# EAGLE design Slave board (EAGLE 9.6.1)
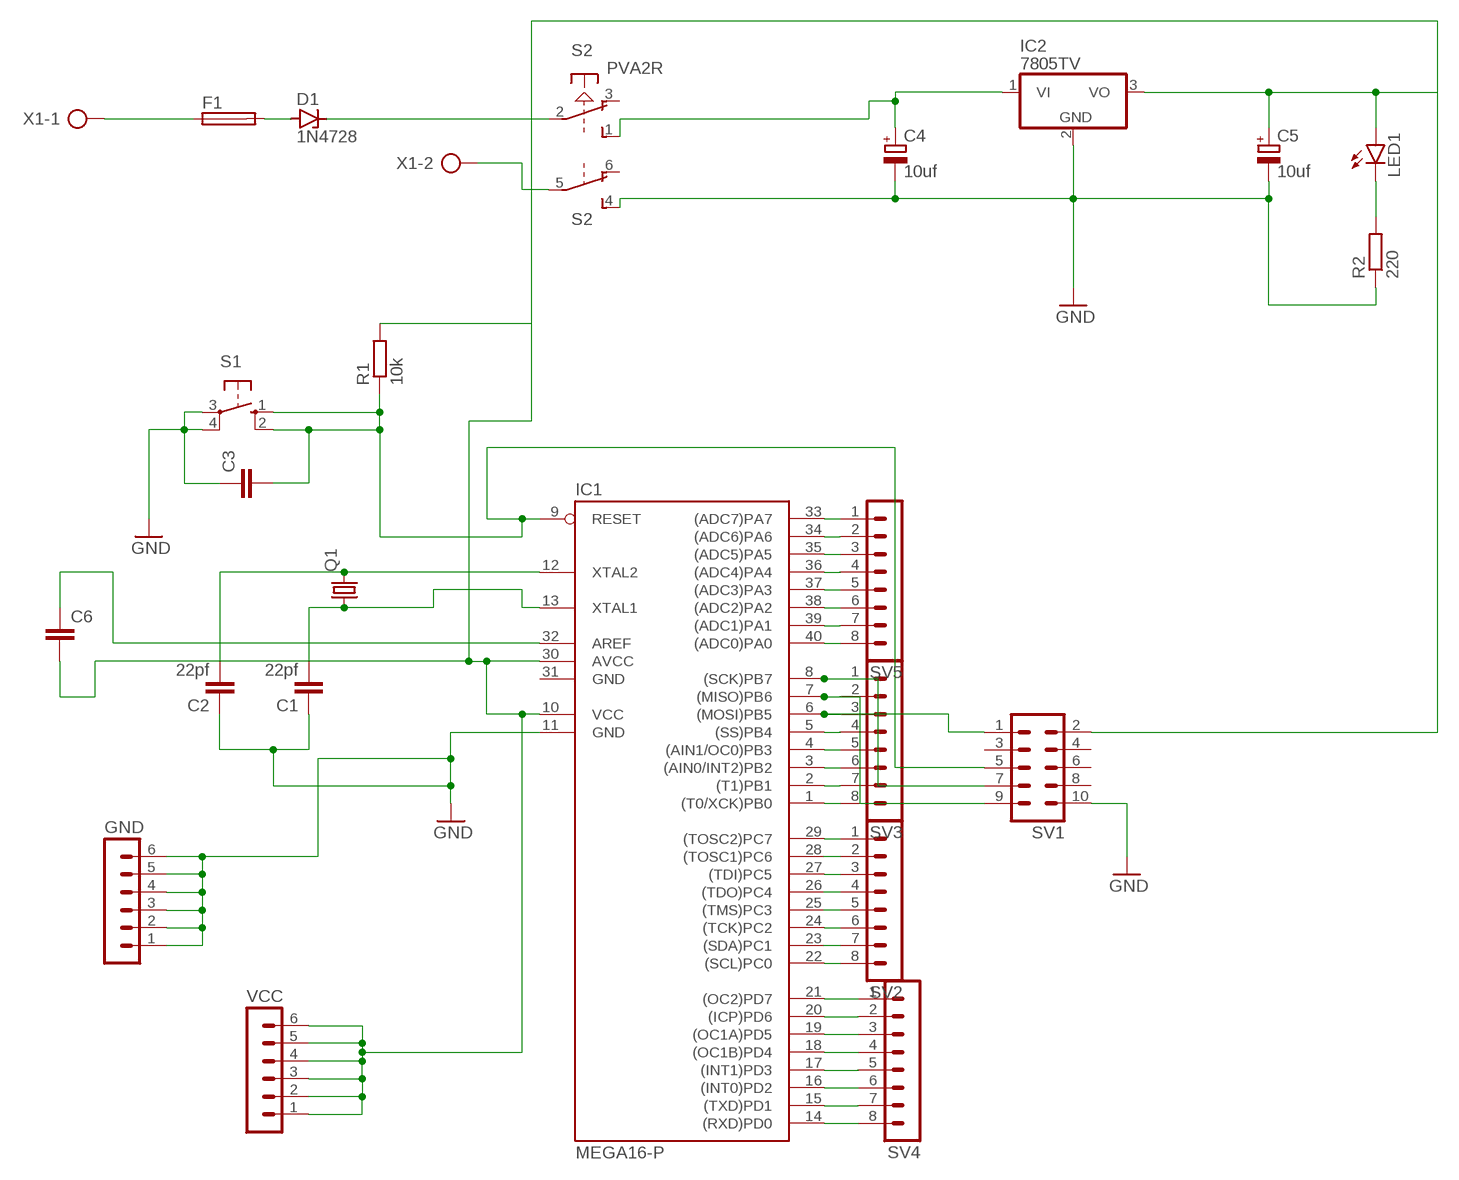
[diagram p0: schematic, sheet 1]

## Parts
C1  22pf  C-EU025-025X050  [C025-025X050]
C2  22pf  C-EU025-025X050  [C025-025X050]
C3  C-EU025-025X050  [C025-025X050]
C4  10uf  CPOL-EUE2.5-6  [E2,5-6]
C5  10uf  CPOL-EUE2.5-6  [E2,5-6]
C6  C-EU025-025X050  [C025-025X050]
D1  1N4728  [DO41Z10]
F1  GSH15  [GSH15]
GND  MA06-1  [MA06-1]
IC1  MEGA16-P  [DIL40]
IC2  7805TV  [TO220V]
LED1  LED5MM  [LED5MM]
Q1  CRYSTALHC49U70  [HC49U70]
R1  10k  R-EU_0207/10  [0207/10]
R2  220  R-EU_0207/10  [0207/10]
S1  10-XX  [B3F-10XX]
S2  PVA2R  [PVA2R]
SV1  MA05-2  [MA05-2]
SV2  MA08-1W  [MA08-1W]
SV3  MA08-1W  [MA08-1W]
SV4  MA08-1W  [MA08-1W]
SV5  MA08-1W  [MA08-1W]
VCC  MA06-1  [MA06-1]
X1  AK500/2  [AK500/2]

## Nets
GND: C1.1 C2.1 C3.1 C4.- C5.- GND.1 GND.2 GND.3 GND.4 GND.5 GND.6 IC1.11(GND) IC2.2(GND) R2.1 S1.3(P) S1.4(P1) S2.4(2:S) SV1.10
N$1: C1.2 IC1.13(XTAL1) Q1.1
N$2: C2.2 IC1.12(XTAL2) Q1.2
N$3: IC1.6((MOSI)PB5) SV1.1 SV3.3
N$4: IC1.7((MISO)PB6) SV1.9 SV3.2
N$5: IC1.8((SCK)PB7) SV1.7 SV3.1
N$6: C4.+ IC2.1(VI) S2.1(1:S)
N$7: IC1.5((SS)PB4) SV3.4
N$8: C3.2 IC1.9(RESET) R1.1 S1.1(S) S1.2(S1) SV1.5
N$9: LED1.K(C) R2.2
N$10: IC1.4((AIN1/OC0)PB3) SV3.5
N$11: IC1.3((AIN0/INT2)PB2) SV3.6
N$12: IC1.2((T1)PB1) SV3.7
N$14: IC1.33((ADC7)PA7) SV5.1
N$15: D1.A F1.2
N$16: F1.1 X1.1
N$17: D1.C S2.2(1:P)
N$18: IC1.34((ADC6)PA6) SV5.2
N$19: S2.5(2:P) X1.2
N$20: IC1.29((TOSC2)PC7) SV2.1
N$22: IC1.27((TDI)PC5) SV2.3
N$23: IC1.26((TDO)PC4) SV2.4
N$24: IC1.25((TMS)PC3) SV2.5
N$25: IC1.24((TCK)PC2) SV2.6
N$26: IC1.23((SDA)PC1) SV2.7
N$27: IC1.22((SCL)PC0) SV2.8
N$28: IC1.35((ADC5)PA5) SV5.3
N$29: IC1.40((ADC0)PA0) SV5.8
N$30: IC1.39((ADC1)PA1) SV5.7
N$31: IC1.38((ADC2)PA2) SV5.6
N$32: IC1.37((ADC3)PA3) SV5.5
N$33: C6.1 IC1.32(AREF)
N$34: IC1.36((ADC4)PA4) SV5.4
N$35: IC1.14((RXD)PD0) SV4.8
N$36: IC1.15((TXD)PD1) SV4.7
N$37: IC1.16((INT0)PD2) SV4.6
N$38: IC1.17((INT1)PD3) SV4.5
N$39: IC1.18((OC1B)PD4) SV4.4
N$40: IC1.19((OC1A)PD5) SV4.3
N$41: C5.+ C6.2 IC1.10(VCC) IC1.30(AVCC) IC2.3(VO) LED1.A R1.2 SV1.2 VCC.1 VCC.2 VCC.3 VCC.4 VCC.5 VCC.6
N$42: IC1.20((ICP)PD6) SV4.2
N$43: IC1.21((OC2)PD7) SV4.1
N$50: IC1.28((TOSC1)PC6) SV2.2
N$52: IC1.1((T0/XCK)PB0) SV3.8
Unconnected: S2.3(1:O) S2.6(2:O) SV1.3 SV1.4 SV1.6 SV1.8

## Power pins joined to a net without a drawn wire
GND: IC1.31(GND)

## Library data of the parts
C1-C3 C6 = rcl:C-EU: CAPACITOR, European symbol; SPICEPREFIX: C
C4 C5 = rcl:CPOL-EU: POLARIZED CAPACITOR, European symbol; SPICEPREFIX: C
D1 = diode:1N4728: Z DIODE 3.3 V, 1W, 5 percent
F1 = fuse:GSH15: FUSE HOLDER grid 15mm, 19649 Wickmann; MPN: 64900001039; OC_FARNELL: 1271673; OC_NEWARK: 02P0318
GND VCC = con-lstb:MA06-1: PIN HEADER; OC_FARNELL: unknown; OC_NEWARK: unknown
IC1 = atmel:MEGA16-P: MICROCONTROLLER 16 Kbytes FLASH 1 kbytes SRAM 512 bytes EEPROM USART 8-channel 10 bit ADC Source: avr.lbr; MPN: ATMEGA16-16PU; OC_FARNELL: 9171142; OC_NEWARK: 01M6885
IC2 = linear:78*: Positive VOLTAGE REGULATOR Source: http://cache.national.com/ds/LM/LM78L05.pdf http://www.fairchildsemi.com/ds/LM/LM7805.pdf
LED1 = led:LED: LED OSRAM: - CHIPLED LG R971, LG N971, LY N971, LG Q971, LY Q971, LO R971, LY R971 LH N974, LH R974 LS Q976, LO Q976, LY Q976 LO Q996 - Hyper CHIPLED LW Q18S LB Q993, LB Q99A, LB R99A - SideLED LS A670, LO A670, LY A670, LG A670, LP A670 LB A673, LV A673, LT A673, LW A673 LH A674 LY A675 LS A676, LA A676, LO A676, LY A676, LW A676 LS A679, LY A679, LG A679 - Hyper Micro SIDELED® LS Y876, LA Y876, LO Y876, LY Y876 LT Y87S - SmartLED LW L88C, LW L88S LB L89C, LB L89S, LG L890 LS L89K, LO L89K, LY L89K LS L896, LA L896, LO L896, LY L896 - TOPLED LS T670, LO T670, LY T670, LG T670, LP T670 LSG T670, LSP T670, LSY T670, LOP T670, LYG T670 LG T671, LOG T671, LSG T671 LB T673, LV T673, LT T673, LW T673 LH T674 LS T676, LA T676, LO T676, LY T676, LB T676, LH T676, LSB T676, LW T676 LB T67C, LV T67C, LT T67C, LS T67K, LO T67K, LY T67K, LW E67C LS E67B, LA E67B, LO E67B, LY E67B, LB E67C, LV E67C, LT E67C LW T67C LS T679, LY T679, LG T679 LS T770, LO T770, LY T770, LG T770, LP T770 LB T773, LV T773, LT T773, LW T773 LH T774 LS E675, LA E675, LY E675, LS T675 LS T776, LA T776, LO T776, LY T776, LB T776 LHGB T686 LT T68C, LB T68C - Hyper Mini TOPLED® LB M676 - Mini TOPLED Santana® LG M470 LS M47K, LO M47K, LY M47K Source: http://www.osram.convergy.de LUXEON: - LUMILED® LXK2-PW12-R00, LXK2-PW12-S00, LXK2-PW14-U00, LXK2-PW14-V00 LXK2-PM12-R00, LXK2-PM12-S00, LXK2-PM14-U00 LXK2-PE12-Q00, LXK2-PE12-R00, LXK2-PE12-S00, LXK2-PE14-T00, LXK2-PE14-U00 LXK2-PB12-K00, LXK2-PB12-L00, LXK2-PB12-M00, LXK2-PB14-N00, LXK2-PB14-P00, LXK2-PB14-Q00 LXK2-PR12-L00, LXK2-PR12-M00, LXK2-PR14-Q00, LXK2-PR14-R00 LXK2-PD12-Q00, LXK2-PD12-R00, LXK2-PD12-S00 LXK2-PH12-R00, LXK2-PH12-S00 LXK2-PL12-P00, LXK2-PL12-Q00, LXK2-PL12-R00 Source: www.luxeon.com KINGBRIGHT: KA-3528ASYC Source: www.kingbright.com
Q1 = crystal:CRYSTAL: CRYSTAL; OC_FARNELL: unknown; OC_NEWARK: unknown
R1 R2 = rcl:R-EU_: RESISTOR, European symbol; SPICEPREFIX: R
S1 = switch-omron:10-XX: OMRON SWITCH; MPN: B3F-1000; OC_FARNELL: 176432; OC_NEWARK: 36M3542
S2 = switch-misc:PVA2R: ITT SWITCH
SV1 = con-lstb:MA05-2: PIN HEADER; OC_FARNELL: unknown; OC_NEWARK: unknown
SV2-SV5 = con-lstb:MA08-1W: PIN HEADER; OC_FARNELL: unknown; OC_NEWARK: unknown
X1 = con-ptr500:AK500/2: CONNECTOR; OC_FARNELL: unknown; OC_NEWARK: unknown

## Board
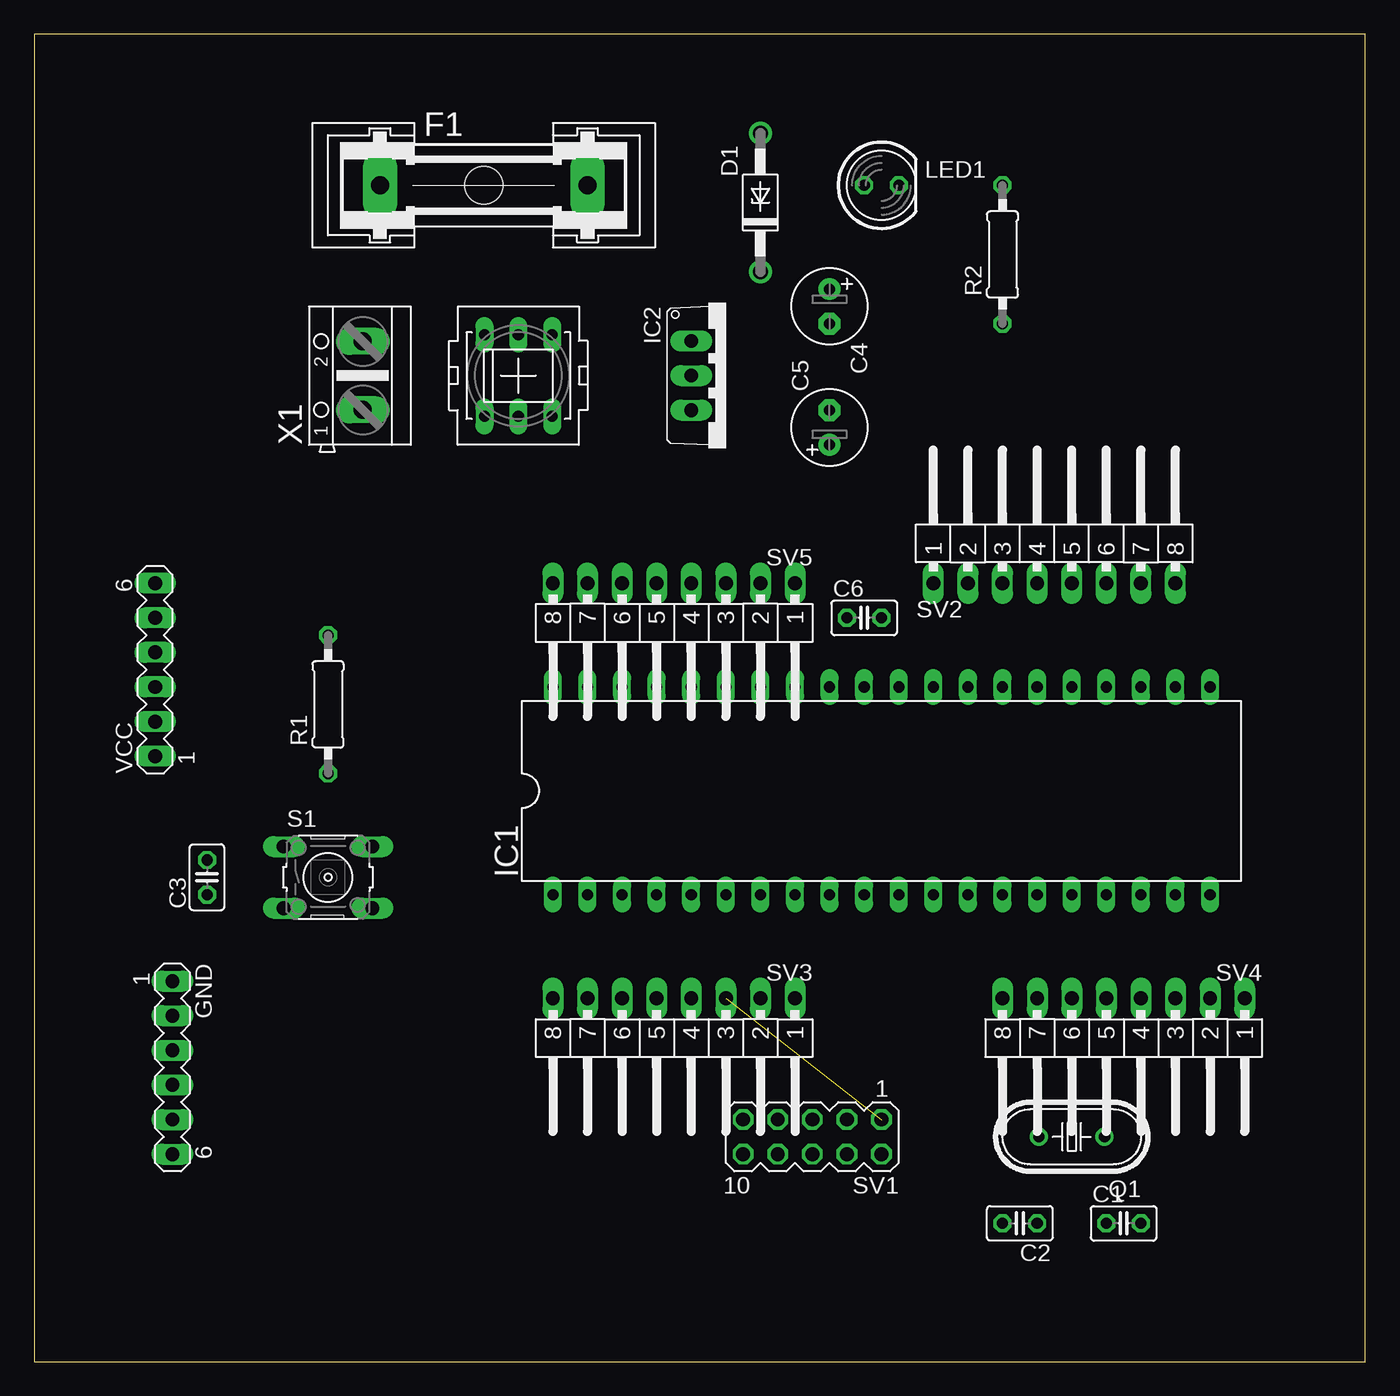
[diagram p1: board, top side]
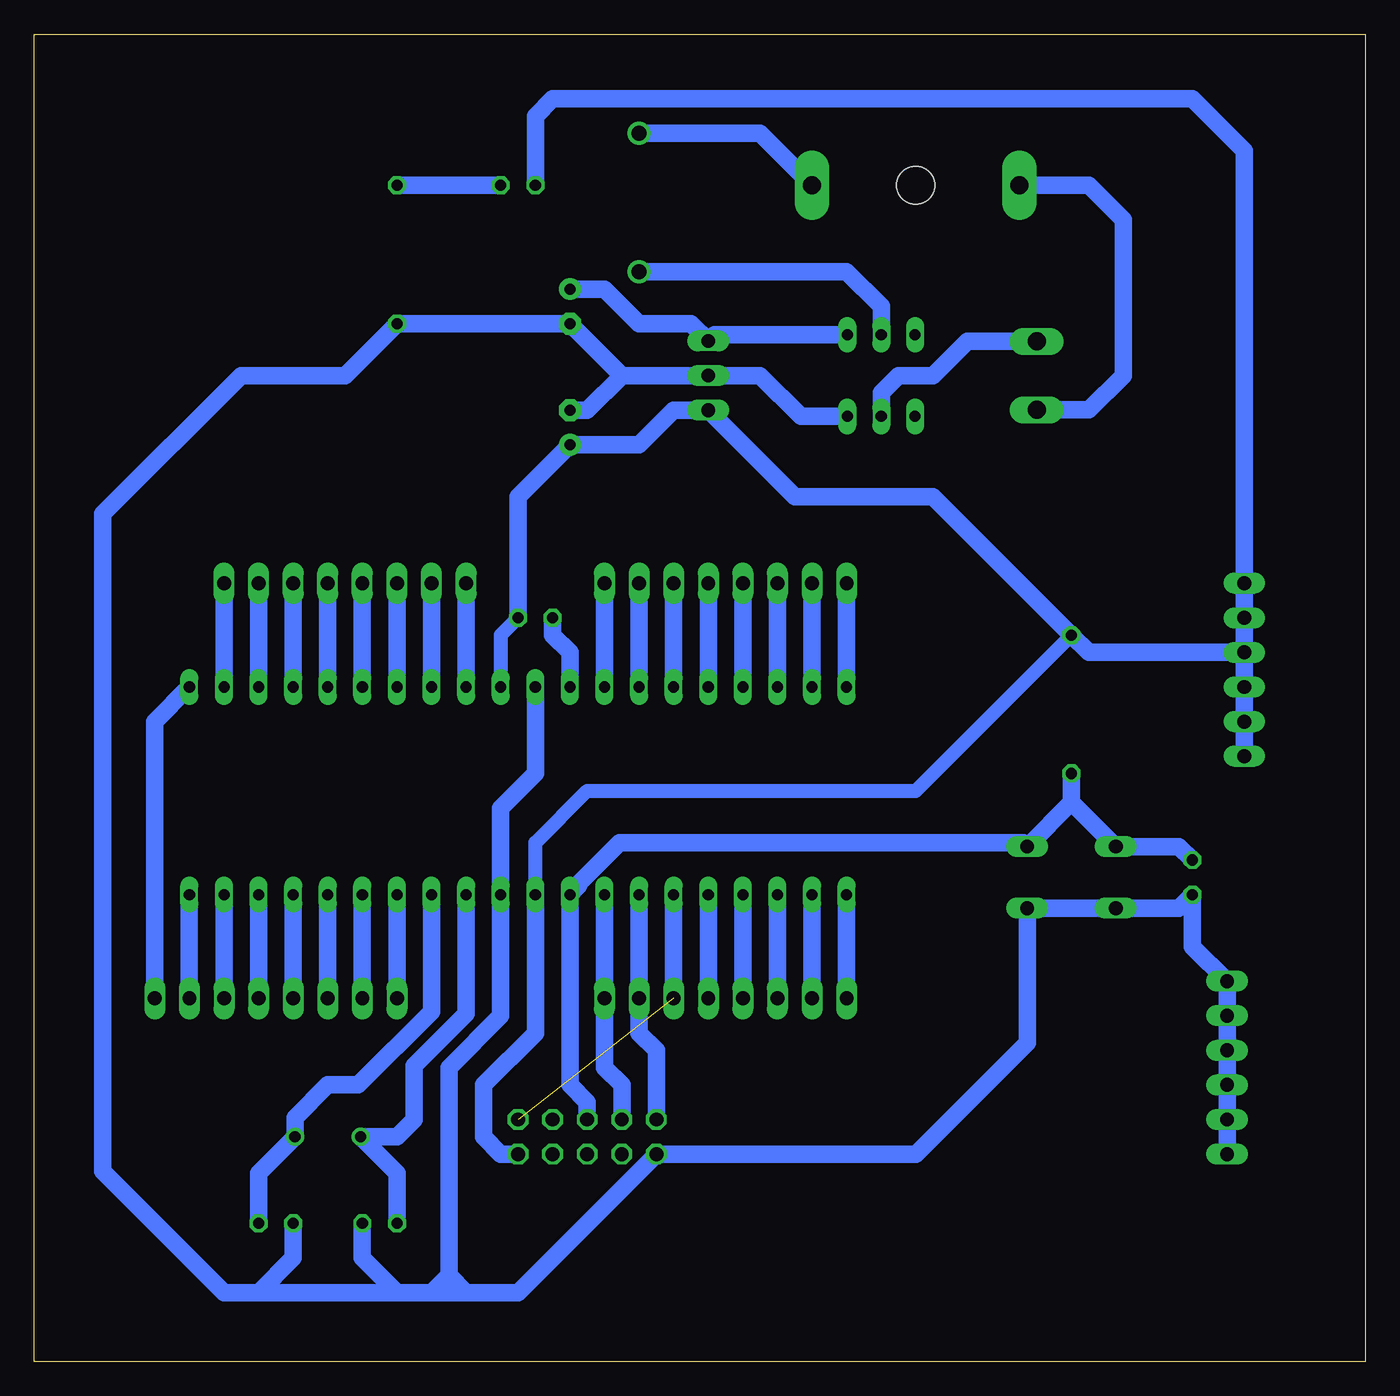
[diagram p2: board, bottom side, seen from below]

Size 97.77 x 97.46 mm. Coordinates in mm from the lower left corner, seen from the top.
Outline: 0,0 97.77,0 97.77,97.46 0,97.46 0,0
Copper layers (1*16): Top 0.035mm / dielectric 1.5mm / Bottom 0.035mm
Design rules "default *": minimum track width 20mil, minimum drill 0.75mm, track to track 30mil, track to pad 30mil, pad to pad 30mil, via to via 25mil, smd to smd 6mil, copper to edge 45mil, drill to drill 15mil, minimum pad ring 10mil, minimum via ring 8mil, stop-mask expansion 4mil, vias tented up to drill 0mil, thermal gap 10mil

### Footprints (pad centres in the part's own frame; a part is rotated, then mirrored left to right if it is on the bottom)
C025-025X050 = drill 0.813 octagon: 1 -1.27,0; 2 1.27,0
E2,5-6 = drill 0.813 pad 1.6: + -1.27,0 | drill 0.813 pad 1.6 octagon: - 1.27,0
DO41Z10 = drill 1.118: A 5.08,0; C -5.08,0
GSH15 = drill 1.321 pad 2.54 long: 1 -7.62,0; 2 7.62,0 | hole 2.794: 0,0
MA06-1 = drill 1.016 long: 1 -6.35,0; 2 -3.81,0; 3 -1.27,0; 4 1.27,0; 5 3.81,0; 6 6.35,0
DIL40 = drill 0.813 long: 1 -24.13,-7.62; 2 -21.59,-7.62; 3 -19.05,-7.62; 4 -16.51,-7.62; 5 -13.97,-7.62; 6 -11.43,-7.62; 7 -8.89,-7.62; 8 -6.35,-7.62; 9 -3.81,-7.62; 10 -1.27,-7.62; 11 1.27,-7.62; 12 3.81,-7.62; 13 6.35,-7.62; 14 8.89,-7.62; 15 11.43,-7.62; 16 13.97,-7.62; 17 16.51,-7.62; 18 19.05,-7.62; 19 21.59,-7.62; 20 24.13,-7.62; 21 24.13,7.62; 22 21.59,7.62; 23 19.05,7.62; 24 16.51,7.62; 25 13.97,7.62; 26 11.43,7.62; 27 8.89,7.62; 28 6.35,7.62; 29 3.81,7.62; 30 1.27,7.62; 31 -1.27,7.62; 32 -3.81,7.62; 33 -6.35,7.62; 34 -8.89,7.62; 35 -11.43,7.62; 36 -13.97,7.62; 37 -16.51,7.62; 38 -19.05,7.62; 39 -21.59,7.62; 40 -24.13,7.62
TO220V = drill 1.016 long: 1 -2.54,-2.54; 2 0,-2.54; 3 2.54,-2.54
LED5MM = drill 0.813 octagon: A -1.27,0; K 1.27,0
HC49U70 = drill 0.813: 1 -2.413,0; 2 2.413,0
0207/10 = drill 0.813 octagon: 1 -5.08,0; 2 5.08,0
B3F-10XX = drill 1.016 long: 1 -3.251,2.261; 2 3.251,2.261; 3 -3.251,-2.261; 4 3.251,-2.261
PVA2R = drill 0.813 long: 1 -2.997,2.489; 2 -2.997,0; 3 -2.997,-2.489; 4 2.997,2.489; 5 2.997,0; 6 2.997,-2.489
MA05-2 = drill 1.016 octagon: 1 -5.08,-1.27; 2 -5.08,1.27; 3 -2.54,-1.27; 4 -2.54,1.27; 5 0,-1.27; 6 0,1.27; 7 2.54,-1.27; 8 2.54,1.27; 9 5.08,-1.27; 10 5.08,1.27
MA08-1W = drill 1.016 long: 1 -8.89,0; 2 -6.35,0; 3 -3.81,0; 4 -1.27,0; 5 1.27,0; 6 3.81,0; 7 6.35,0; 8 8.89,0
AK500/2 = drill 1.321 long: 1 -2.515,0; 2 2.515,0

### Placement (x,y rotation side)
C1  80.01,10.16 0 top
C2  72.39,10.16 180 top
C3  12.7,35.56 90 top
C4  58.42,77.47 270 top
C5  58.42,68.58 90 top
C6  60.96,54.61 0 top
D1  53.34,85.09 90 top
F1  33.02,86.36 0 top
GND  10.16,21.59 270 top
IC1  62.23,41.91 0 top
IC2  50.8,72.39 270 top
LED1  62.23,86.36 0 top
Q1  76.2,16.51 180 top
R1  21.59,48.26 90 top
R2  71.12,81.28 90 top
S1  21.59,35.56 0 top
S2  35.56,72.39 270 top
SV1  57.15,16.51 180 top
SV2  74.93,57.15 0 top
SV3  46.99,26.67 180 top
SV4  80.01,26.67 180 top
SV5  46.99,57.15 180 top
VCC  8.89,50.8 90 top
X1  24.13,72.39 90 top

### Tracks (layer width: path | path; a pad name or v marks a point on that pad's centre or on a via)
GND
  Bottom 1.27: 54.61,72.39 IC2.2 44.45,72.39 41.45,69.39 S2.4 | 54.61,72.39 C4.- R2.1 74.93,72.39 82.55,72.39 92.71,62.23 92.71,13.97 83.82,5.08 81.28,5.08 | IC1.31 60.96,43.18 63.5,40.64 IC1.11 63.5,25.4 67.31,21.59 67.31,6.35 | GND.6 GND.5 GND.4 GND.3 GND.2 GND.1 12.7,30.48 C3.1 13.69,33.3 S1.3 S1.4 24.84,23.42 33.02,15.24 SV1.10 62.23,5.08 66.04,5.08 | C2.1 73.66,7.62 73.03,6.99 71.12,5.08 | 71.12,5.08 68.58,5.08 | 68.58,5.08 67.31,5.08 | 67.31,5.08 66.04,5.08 | 67.31,5.08 67.31,6.35 | 81.28,5.08 71.12,5.08 | C1.1 78.74,7.62 81.28,5.08 | C5.- 57.15,69.85 54.61,72.39 | 67.31,6.35 66.04,5.08 | 67.31,6.35 68.58,5.08
N$1
  Bottom 1.27: IC1.13 68.58,25.71 73.97,20.32 76.2,20.32 78.61,17.91 Q1.1 81.28,13.84 C1.2
N$2
  Bottom 1.27: IC1.12 66.04,25.55 69.85,21.74 69.85,17.78 71.12,16.51 Q1.2 71.12,13.84 C2.2
N$3  (1 unrouted)
  Bottom 1.27: IC1.6 SV3.3
N$4
  Bottom 1.27: IC1.7 SV3.2 53.34,24.13 52.07,22.86 SV1.9
N$5
  Bottom 1.27: IC1.8 SV3.1 55.88,21.59 54.61,20.32 SV1.7
N$6
  Bottom 1.27: S2.1 47.8,75.39 IC2.1 49.53,76.2 53.34,76.2 55.88,78.74 C4.+
N$7
  Bottom 1.27: IC1.5 SV3.4
N$8
  Bottom 1.27: 21.59,41.07 S1.2 25.12,38.1 54.78,38.1 57.78,35.09 57.78,34.93 IC1.9 58.42,20.32 57.15,19.05 SV1.5 | 21.59,41.07 S1.1 13.69,37.82 C3.2 | 21.59,41.07 R1.1
N$9
  Bottom 1.27: LED1.K R2.2
N$10
  Bottom 1.27: IC1.4 SV3.5
N$11
  Bottom 1.27: IC1.3 SV3.6
N$12
  Bottom 1.27: IC1.2 SV3.7
N$14
  Bottom 1.27: SV5.1 IC1.33
N$15
  Bottom 1.27: F1.2 44.45,90.17 D1.A
N$16
  Bottom 1.27: X1.1 20.3,69.88 17.78,72.39 17.78,83.82 20.32,86.36 F1.1
N$17
  Bottom 1.27: S2.2 35.56,77.47 38.1,80.01 D1.C
N$18
  Bottom 1.27: SV5.2 IC1.34
N$19
  Bottom 1.27: X1.2 29.23,74.91 31.75,72.39 34.29,72.39 35.56,71.12 S2.5
N$20
  Bottom 1.27: SV2.1 IC1.29
N$22
  Bottom 1.27: SV2.3 IC1.27
N$23
  Bottom 1.27: SV2.4 IC1.26
N$24
  Bottom 1.27: SV2.5 IC1.25
N$25
  Bottom 1.27: SV2.6 IC1.24
N$26
  Bottom 1.27: SV2.7 IC1.23
N$27
  Bottom 1.27: SV2.8 IC1.22
N$28
  Bottom 1.27: SV5.3 IC1.35
N$29
  Bottom 1.27: SV5.8 IC1.40
N$30
  Bottom 1.27: SV5.7 IC1.39
N$31
  Bottom 1.27: SV5.6 IC1.38
N$32
  Bottom 1.27: SV5.5 IC1.37
N$33
  Bottom 1.27: C6.1 59.69,53.34 58.42,52.07 IC1.32
N$34
  Bottom 1.27: SV5.4 IC1.36
N$35
  Bottom 1.27: IC1.14 SV4.8
N$36
  Bottom 1.27: IC1.15 SV4.7
N$37
  Bottom 1.27: IC1.16 SV4.6
N$38
  Bottom 1.27: IC1.17 SV4.5
N$39
  Bottom 1.27: IC1.18 SV4.4
N$40
  Bottom 1.27: IC1.19 SV4.3
N$41
  Bottom 1.016: IC1.10 60.96,38.1 57.15,41.91 33.02,41.91 R1.2 | C6.2 63.5,53.34 IC1.30
  Bottom 1.27: VCC.4 20.32,52.07 R1.2 31.75,63.5 41.91,63.5 IC2.3 50.8,69.85 53.34,67.31 C5.+ 62.23,63.5 C6.2 | VCC.4 VCC.5 VCC.6 8.89,88.9 12.7,92.71 59.69,92.71 60.96,91.44 LED1.A | VCC.4 VCC.3 VCC.2 VCC.1 | IC1.10 60.96,24.13 64.77,20.32 64.77,16.51 63.5,15.24 SV1.2
N$42
  Bottom 1.27: IC1.20 SV4.2
N$43
  Bottom 1.27: IC1.21 88.9,46.99 SV4.1
N$50
  Bottom 1.27: SV2.2 IC1.28
N$52
  Bottom 1.27: IC1.1 SV3.8